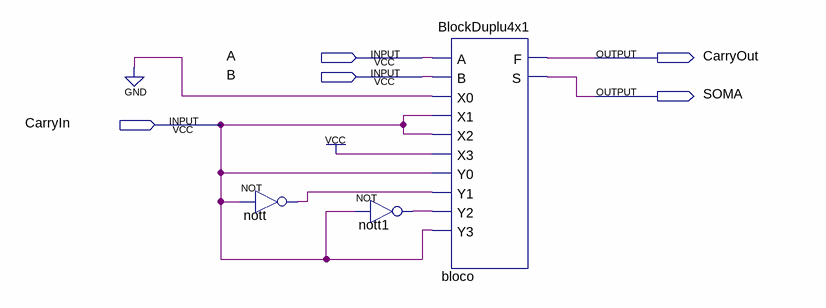
[diagram p0: schematic sheet]
// Quartus schematic SomadorCompleto.bdf as structural Verilog: 3 symbols, 5 pins
module SomadorCompleto (
  input  A,
  input  B,
  input  CarryIn,
  output CarryOut,
  output SOMA
);

  wire nott1_out, nott_out;

  not nott (nott_out, CarryIn);
  not nott1 (nott1_out, CarryIn);
  BlockDuplu4x1 bloco (
    .A(A), .B(B), .X0(1'b0), .X1(CarryIn), .X2(CarryIn), .X3(1'b1), .Y0(CarryIn), .Y1(nott_out),
    .Y2(nott1_out), .Y3(CarryIn), .F(CarryOut), .S(SOMA));
endmodule
